# Altium schematic sheet schemat.SchDoc
size A4
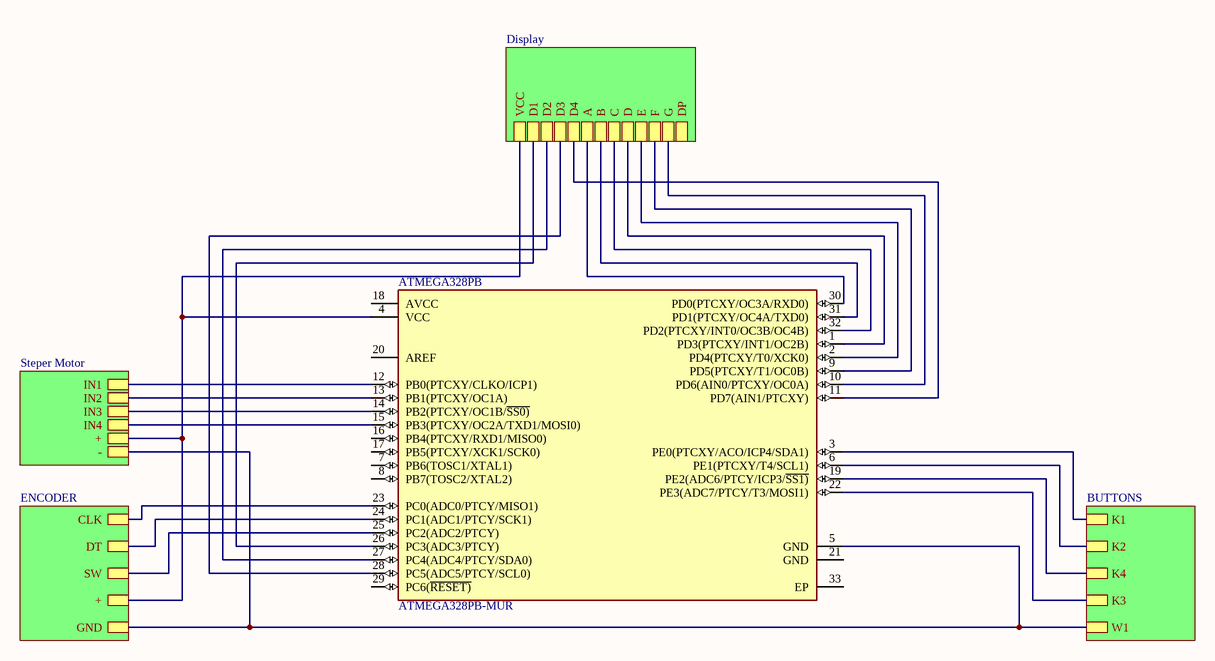
[diagram p0: schemat.SchDoc]

## Parts
ATMEGA328PB  ATMEGA328PB-MUR  [FP-32MS1-MFG]

## Sub-sheets
? = ENCODER: CLK, DT, SW, +, GND
? = BUTTONS: K4, K3, K2, K1, W1
? = Display: VCC, D1, D2, D3, D4, A, B, C, D, E, F, G, DP
? = Steper Motor: IN1, IN2, IN3, IN4, +, -

## Nets
NetATMEGA328PB_1: ATMEGA328PB.1(PD3(PTCXY/INT1/OC2B)) ; sheet /D
NetATMEGA328PB_2: ATMEGA328PB.2(PD4(PTCXY/T0/XCK0)) ; sheet /E
NetATMEGA328PB_3: ATMEGA328PB.3(PE0(PTCXY/ACO/ICP4/SDA1)) ; sheet /K1
NetATMEGA328PB_4: ATMEGA328PB.4(VCC) ; sheet /+, sheet /VCC, sheet /+
NetATMEGA328PB_5: ATMEGA328PB.5(GND) ; sheet /GND, sheet /W1, sheet /-
NetATMEGA328PB_6: ATMEGA328PB.6(PE1(PTCXY/T4/SCL1)) ; sheet /K2
NetATMEGA328PB_9: ATMEGA328PB.9(PD5(PTCXY/T1/OC0B)) ; sheet /F
NetATMEGA328PB_10: ATMEGA328PB.10(PD6(AIN0/PTCXY/OC0A)) ; sheet /G
NetATMEGA328PB_11: ATMEGA328PB.11(PD7(AIN1/PTCXY)) ; sheet /D4
NetATMEGA328PB_12: ATMEGA328PB.12(PB0(PTCXY/CLKO/ICP1)) ; sheet /IN1
NetATMEGA328PB_13: ATMEGA328PB.13(PB1(PTCXY/OC1A)) ; sheet /IN2
NetATMEGA328PB_14: ATMEGA328PB.14(PB2(PTCXY/OC1B/~{SS0)}) ; sheet /IN3
NetATMEGA328PB_15: ATMEGA328PB.15(PB3(PTCXY/OC2A/TXD1/MOSI0)) ; sheet /IN4
NetATMEGA328PB_19: ATMEGA328PB.19(PE2(ADC6/PTCY/ICP3/~{SS1)}) ; sheet /K4
NetATMEGA328PB_22: ATMEGA328PB.22(PE3(ADC7/PTCY/T3/MOSI1)) ; sheet /K3
NetATMEGA328PB_23: ATMEGA328PB.23(PC0(ADC0/PTCY/MISO1)) ; sheet /CLK
NetATMEGA328PB_24: ATMEGA328PB.24(PC1(ADC1/PTCY/SCK1)) ; sheet /DT
NetATMEGA328PB_25: ATMEGA328PB.25(PC2(ADC2/PTCY)) ; sheet /SW
NetATMEGA328PB_26: ATMEGA328PB.26(PC3(ADC3/PTCY)) ; sheet /D1
NetATMEGA328PB_27: ATMEGA328PB.27(PC4(ADC4/PTCY/SDA0)) ; sheet /D2
NetATMEGA328PB_28: ATMEGA328PB.28(PC5(ADC5/PTCY/SCL0)) ; sheet /D3
NetATMEGA328PB_30: ATMEGA328PB.30(PD0(PTCXY/OC3A/RXD0)) ; sheet /A
NetATMEGA328PB_31: ATMEGA328PB.31(PD1(PTCXY/OC4A/TXD0)) ; sheet /B
NetATMEGA328PB_32: ATMEGA328PB.32(PD2(PTCXY/INT0/OC3B/OC4B)) ; sheet /C

Not connected (* = marked no-connect by the designer): ATMEGA328PB 7(PB6(TOSC1/XTAL1)) 8(PB7(TOSC2/XTAL2)) 16(PB4(PTCXY/RXD1/MISO0)) 17(PB5(PTCXY/XCK1/SCK0)) 18(AVCC) 20(AREF) 21(GND) 29(PC6(~{RESET)}) 33(EP)

## Library data of the parts
ATMEGA328PB = CMP-06276-000033-1: IC MCU 8BIT 32KB FLASH 32VFQFN; Manufacturer: Microchip; Nominal Supply Current: 0.06-5.2mA; Interface: I2C,SPI,UART,USART,2-Wire; Number Of A/D Converters: 1; Number Of Pwm Channels: 10; Min Supply Voltage: 1.8V; Core Architecture: AVR; Memory Size: 32KBytes; Number Of I/Os: 27; Number Of Timers/Counters: 5; Max Supply Voltage: 5.5V; Frequency: 20MHz; Number Of Adc Channels: 8; Number Of Spi Channels: 2; Standoff Height: 0mm; Data Bus Width: 8bits; Ram Size: 2KBytes; ComponentLink2Description: Datasheet; Temperature Range High: +85°C; Category: IC; Lead Free: Yes; Device Class L2: Embedded Processors and Controllers; Package: 32MS1; Height: 0.9mm; Temperature Range Low: -40°C; Digikey Description: IC MCU 8BIT 32KB FLASH 32VFQFN; Ipc Land Pattern Name: QFN50P500X500X85-32; RoHS: TRUE; Device Class L1: Integrated Circuits (ICs); Footprint Url: http://ww1.microchip.com/downloads/en/Appnotes/Atmel-8826-SEEPROM-PCB-Mounting-Guidelines-Surface-Mount-Packages-ApplicationNote.pdf; Temperature: -40°C to +85°C; Memory Type: FLASH; Automotive: No; ComponentLink2URL: http://ww1.microchip.com/downloads/en/DeviceDoc/40001906C.pdf; Device Class L3: Microcontrollers; Octopart: https://octopart.com/atmega328pb-mur-microchip-77760233; Manufacturer Part Number: ATMEGA328PB-MUR; Number Of Cores: 1; Number Of I2C Channels: 2; Number Of Uart Channels: 2